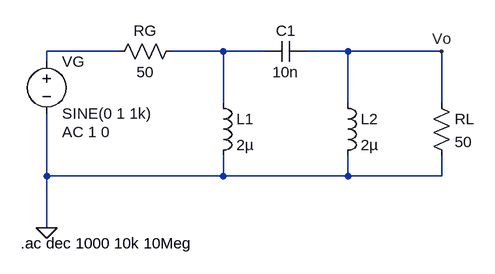
[diagram p0: schematic ej4.asc]
ej4.asc, the LTspice schematic file:
Version 4
SHEET 1 880 680
WIRE 192 112 80 112
WIRE 352 112 272 112
WIRE 416 112 352 112
WIRE 544 112 480 112
WIRE 688 112 544 112
WIRE 80 128 80 112
WIRE 352 192 352 112
WIRE 544 192 544 112
WIRE 688 192 688 112
WIRE 80 304 80 208
WIRE 352 304 352 272
WIRE 352 304 80 304
WIRE 544 304 544 272
WIRE 544 304 352 304
WIRE 688 304 688 272
WIRE 688 304 544 304
WIRE 80 384 80 304
FLAG 80 384 0
FLAG 688 112 Vo
SYMBOL voltage 80 112 R0
WINDOW 123 24 124 Left 2
WINDOW 39 0 0 Left 0
SYMATTR InstName VG
SYMATTR Value SINE(0 1 1k)
SYMATTR Value2 AC 1 0
SYMBOL res 288 96 R90
WINDOW 0 0 56 VBottom 2
WINDOW 3 32 56 VTop 2
SYMATTR InstName RG
SYMATTR Value 50
SYMBOL cap 480 96 R90
WINDOW 0 0 32 VBottom 2
WINDOW 3 32 32 VTop 2
SYMATTR InstName C1
SYMATTR Value 10n
SYMBOL ind 336 176 R0
SYMATTR InstName L1
SYMATTR Value 2µ
SYMBOL ind 528 176 R0
SYMATTR InstName L2
SYMATTR Value 2µ
SYMBOL res 672 176 R0
SYMATTR InstName RL
SYMATTR Value 50
TEXT 40 408 Left 2 !.ac dec 1000 10k 10Meg

The netlist it stands for:
* ej4.asc
VG N001 0 SINE(0 1 1k) AC 1 0
RG N002 N001 50
C1 Vo N002 10n
L1 N002 0 2µ
L2 Vo 0 2µ
RL Vo 0 50
.ac dec 1000 10k 10Meg
.backanno
.end